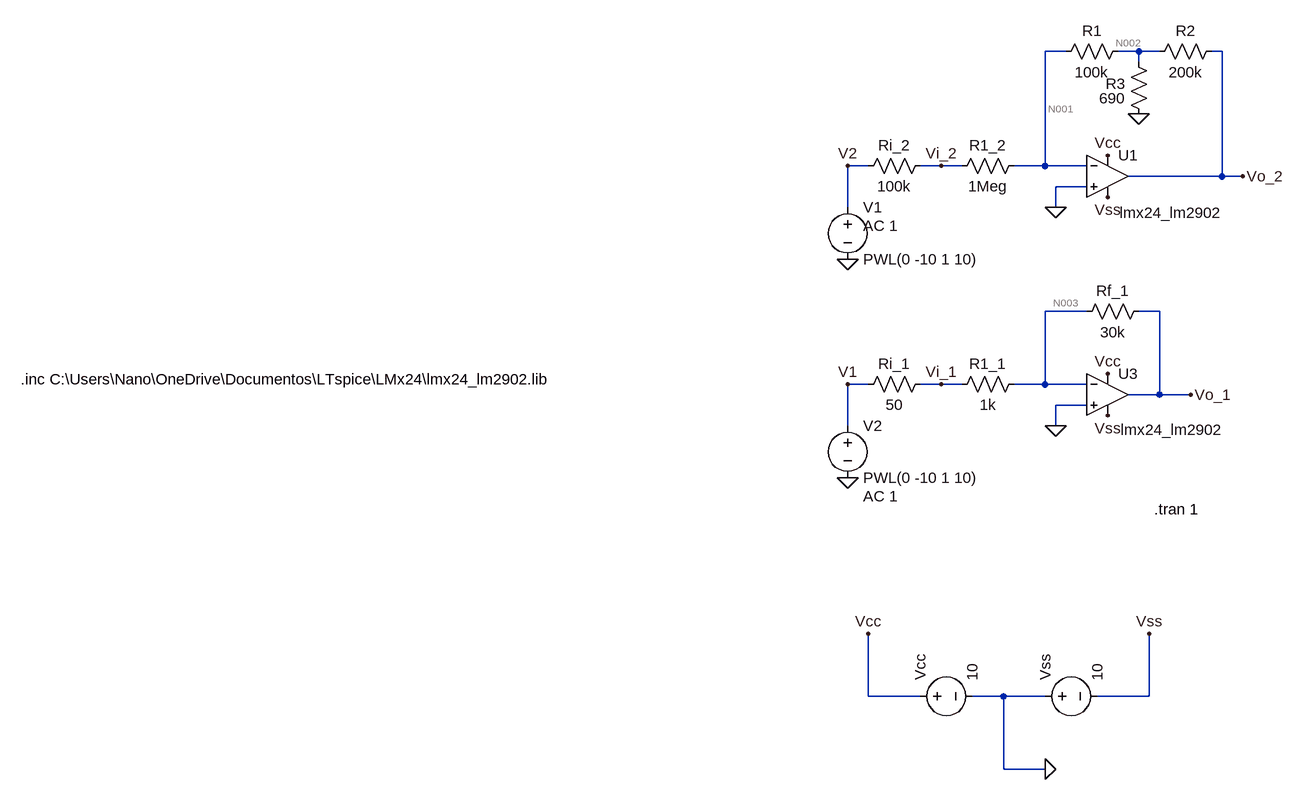
[diagram p0: schematic schematic.asc]
schematic.asc, the LTspice schematic file:
Version 4.1
SHEET 1 4928 1016
WIRE -368 -528 -400 -528
WIRE -256 -528 -288 -528
WIRE -224 -528 -256 -528
WIRE -128 -528 -144 -528
WIRE -256 -512 -256 -528
WIRE -672 -352 -704 -352
WIRE -560 -352 -592 -352
WIRE -528 -352 -560 -352
WIRE -400 -352 -400 -528
WIRE -400 -352 -448 -352
WIRE -336 -352 -400 -352
WIRE -128 -336 -128 -528
WIRE -128 -336 -272 -336
WIRE -96 -336 -128 -336
WIRE -336 -320 -384 -320
WIRE -704 -288 -704 -352
WIRE -384 -288 -384 -320
WIRE -336 -128 -400 -128
WIRE -224 -128 -256 -128
WIRE -672 -16 -704 -16
WIRE -560 -16 -592 -16
WIRE -528 -16 -560 -16
WIRE -400 -16 -400 -128
WIRE -400 -16 -448 -16
WIRE -336 -16 -400 -16
WIRE -224 0 -224 -128
WIRE -224 0 -272 0
WIRE -176 0 -224 0
WIRE -336 16 -384 16
WIRE -704 48 -704 -16
WIRE -384 48 -384 16
WIRE -672 464 -672 368
WIRE -592 464 -672 464
WIRE -464 464 -512 464
WIRE -400 464 -464 464
WIRE -240 464 -240 368
WIRE -240 464 -320 464
WIRE -464 576 -464 464
WIRE -400 576 -464 576
FLAG -400 576 0
FLAG -672 368 Vcc
FLAG -240 368 Vss
FLAG -304 -32 Vcc
FLAG -304 32 Vss
FLAG -176 0 Vo_1
FLAG -560 -16 Vi_1
FLAG -704 -16 V1
FLAG -384 48 0
FLAG -304 -368 Vcc
FLAG -304 -304 Vss
FLAG -96 -336 Vo_2
FLAG -560 -352 Vi_2
FLAG -704 -352 V2
FLAG -384 -288 0
FLAG -256 -432 0
FLAG -704 -208 0
FLAG -704 128 0
SYMBOL voltage -608 464 R270
WINDOW 123 0 0 Left 0
WINDOW 39 0 0 Left 0
SYMATTR InstName Vcc
SYMATTR Value 10
SYMBOL voltage -416 464 R270
WINDOW 123 0 0 Left 0
WINDOW 39 0 0 Left 0
SYMATTR InstName Vss
SYMATTR Value 10
SYMBOL OpAmps\\opamp2 -304 -64 R0
WINDOW 3 20 118 Left 2
SYMATTR Value lmx24_lm2902
SYMATTR InstName U3
SYMBOL res -576 -32 R90
WINDOW 0 0 56 VBottom 2
WINDOW 3 32 56 VTop 2
SYMATTR InstName Ri_1
SYMATTR Value 50
SYMATTR SpiceLine tol=1
SYMBOL res -240 -144 R90
WINDOW 0 0 56 VBottom 2
WINDOW 3 32 56 VTop 2
SYMATTR InstName Rf_1
SYMATTR Value 30k
SYMBOL res -432 -32 R90
WINDOW 0 0 56 VBottom 2
WINDOW 3 32 56 VTop 2
SYMATTR InstName R1_1
SYMATTR Value 1k
SYMBOL OpAmps\\opamp2 -304 -400 R0
WINDOW 3 19 120 Left 2
SYMATTR Value lmx24_lm2902
SYMATTR InstName U1
SYMBOL res -576 -368 R90
WINDOW 0 0 56 VBottom 2
WINDOW 3 32 56 VTop 2
SYMATTR InstName Ri_2
SYMATTR Value 100k
SYMATTR SpiceLine tol=1
SYMBOL res -432 -368 R90
WINDOW 0 0 56 VBottom 2
WINDOW 3 32 56 VTop 2
SYMATTR InstName R1_2
SYMATTR Value 1Meg
SYMBOL res -272 -544 R90
WINDOW 0 0 56 VBottom 2
WINDOW 3 32 56 VTop 2
SYMATTR InstName R1
SYMATTR Value 100k
SYMBOL res -128 -544 R90
WINDOW 0 0 56 VBottom 2
WINDOW 3 32 56 VTop 2
SYMATTR InstName R2
SYMATTR Value 200k
SYMBOL res -240 -416 R180
WINDOW 0 36 62 Left 2
WINDOW 3 36 40 Left 2
SYMATTR InstName R3
SYMATTR Value 690
SYMBOL voltage -704 -304 R0
WINDOW 123 24 44 Left 2
WINDOW 39 0 0 Left 0
SYMATTR InstName V1
SYMATTR Value PWL(0 -10 1 10)
SYMATTR Value2 AC 1
SYMBOL voltage -704 32 R0
WINDOW 123 24 124 Left 2
WINDOW 39 0 0 Left 0
SYMATTR InstName V2
SYMATTR Value PWL(0 -10 1 10)
SYMATTR Value2 AC 1
TEXT -1976 -24 Left 2 !.inc C:\\Users\\Nano\\OneDrive\\Documentos\\LTspice\\LMx24\\lmx24_lm2902.lib
TEXT -232 176 Left 2 !.tran 1

The netlist it stands for:
* schematic.asc
Vcc Vcc 0 10
Vss 0 Vss 10
X§U3 0 N003 Vcc Vss Vo_1 lmx24_lm2902  ; pins In+ In- V+ V- OUT
Ri_1 Vi_1 V1 50 tol=1
Rf_1 Vo_1 N003 30k
R1_1 N003 Vi_1 1k
X§U1 0 N001 Vcc Vss Vo_2 lmx24_lm2902  ; pins In+ In- V+ V- OUT
Ri_2 Vi_2 V2 100k tol=1
R1_2 N001 Vi_2 1Meg
R1 N002 N001 100k
R2 Vo_2 N002 200k
R3 0 N002 690
V1 V2 0 PWL(0 -10 1 10) AC 1
V2 V1 0 PWL(0 -10 1 10) AC 1
.inc C:\Users\Nano\OneDrive\Documentos\LTspice\LMx24\lmx24_lm2902.lib
.tran 1
.backanno
.end

* Results of the author's LTspice run, read from the files saved beside the schematic
* Operating Point, zero values left out:
*   V(vss) = -10 V
*   V(vo_1) = 8.765 V
*   V(vi_1) = -9.97 V
*   V(n001) = -809.1 mV
*   V(v2) = -10 V
*   V(vcc) = 10 V
*   V(n003) = -9.365 V
*   V(v1) = -10 V
*   V(vo_2) = 8.821 V
*   V(vi_2) = -9.164 V
*   V(n002) = 24.59 mV
*   I(Vcc) = -998.3 µA
*   I(R1_2) = 8.355 µA
*   I(R3) = -35.64 µA
*   I(Ri_1) = 604.4 µA
*   I(R1_1) = 604.4 µA
*   I(V2) = 604.4 µA
*   I(Rf_1) = 604.3 µA
*   I(Ri_2) = 8.355 µA
*   I(R2) = 43.98 µA
*   I(V1) = 8.355 µA
*   I(Vss) = -350 µA
*   I(R1) = 8.337 µA
*   Ix(u3:in+) = -20 nA
*   Ix(u3:in-) = -18.01 nA
*   Ix(u3:vcc) = 779.3 µA
*   Ix(u3:vee) = -175 µA
*   Ix(u3:out) = -604.3 µA
*   Ix(u1:in+) = -20 nA
*   Ix(u1:in-) = -18 nA
*   Ix(u1:vcc) = 219 µA
*   Ix(u1:vee) = -175 µA
*   Ix(u1:out) = -43.98 µA
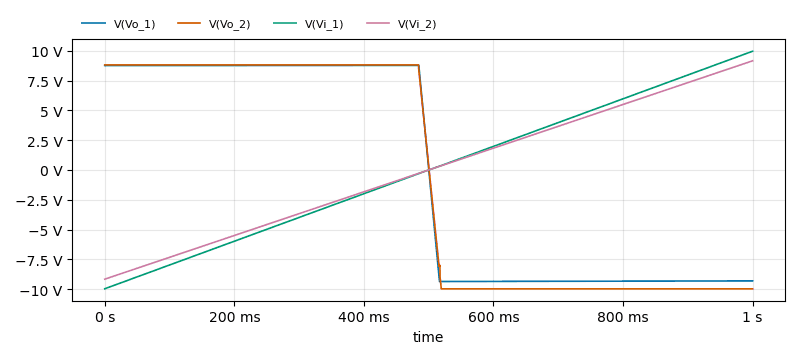
[diagram p1: Transient Analysis of schematic.asc, plotted from the saved traces]
* Transient Analysis, 1 run:
*   V(Vo_1): min -9.36 V, max 8.783 V, average -269.3 mV, rms 8.963 V, last -9.31 V
*   V(Vo_2): min -9.976 V, max 8.821 V, average -545.1 mV, rms 9.303 V, last -9.976 V
*   V(Vi_1): min -9.97 V, max 9.969 V, average -432.8 µV, rms 6.702 V, last 9.969 V
*   V(Vi_2): min -9.164 V, max 9.164 V, average -5.105 µV, rms 6.162 V, last 9.164 V